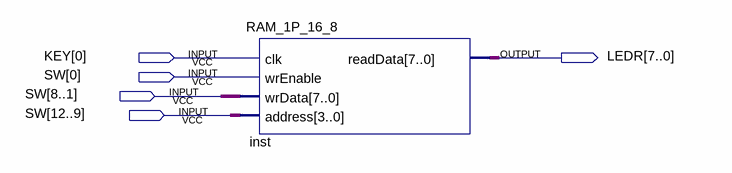
[diagram p0: schematic sheet]
// Quartus schematic RAM_1P_Demo.bdf as structural Verilog: 1 symbols, 5 pins
module RAM_1P_Demo (
  input  [0:0] KEY,
  input  [12:0] SW,
  output [7:0] LEDR
);

  RAM_1P_16_8 inst (.clk(KEY[0]), .wrEnable(SW[0]), .wrData(SW[8:1]), .address(SW[12:9]), .readData(LEDR));
endmodule
